# Altium schematic sheet Sheet1.SchDoc
size A1
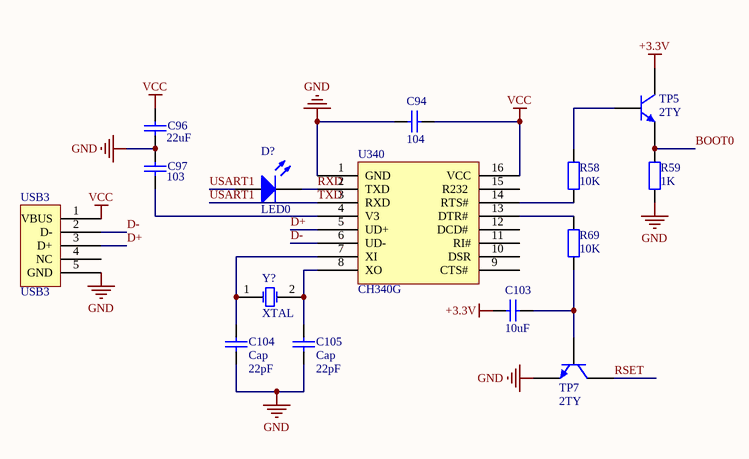
[diagram p0: Sheet1.SchDoc]

## Parts
C94  104  [RAD-0.3]
C96  value 22uF  [RAD-0.3]
C97  value 103  [RAD-0.3]
C103  10uF  [RAD-0.3]
C104  Cap  value 22pF  [RAD-0.3]
C105  Cap  value 22pF  [RAD-0.3]
D?  LED0  [LED-0]
R58  10K  [AXIAL-0.4]
R59  1K  [AXIAL-0.4]
R69  10K  [AXIAL-0.4]
TP5  2TY  [TO-92A]
TP7  2TY  [TO-92A]
U340  CH340G
USB3  USB3
Y?  XTAL  [R38]

## Nets
+3.3V: C103.2 TP5.3(C)
GND: C94.1 C96.1 C97.1 C104.1 C105.1 R59.1 TP7.1(E) U340.1(GND) USB3.5(GND)
VCC: C94.2 C96.2 U340.16(VCC) USB3.1(VBUS)
BOOT0: R59.2 TP5.1(E)
D+: U340.5(UD+) USB3.3(D+)
D-: U340.6(UD-) USB3.2(D-)
RSET: TP7.3(C)
RXD: D?.2(K) U340.2(TXD)
TXD: D?.1(A) U340.3(RXD)  [also labelled USART1]
NetC97_2: C97.2 U340.4(V3)
NetC103_1: C103.1 R69.1 TP7.2(B)
NetC104_2: C104.2 U340.7(XI) Y?.1(OSC1)
NetC105_2: C105.2 U340.8(XO) Y?.2(OSC2)
NetR58_1: R58.1 U340.14(RTS#)
NetR58_2: R58.2 TP5.2(B)
NetR69_2: R69.2 U340.13(DTR#)

Not connected (* = marked no-connect by the designer): U340 9(CTS#_) 10(DSR) 11(RI#) 12(DCD#_) 15(R232_); USB3 4(NC)

## Notes on the sheet
- Title
- Size:
- Date:
- File:
- A1
- Number:
- Time:
- Revision:
- Sheet
- of

## Library data of the parts
C94 = Cap: Capacitor; Value: 100pF; Published: 8-Jun-2000; LatestRevisionDate: 17-Jul-2002; LatestRevisionNote: Re-released for DXP Platform.; PackageReference: RAD-0.3; Publisher: Altium Limited; PackageDescription: Radial Cap, Thru-Hole; 2 Leads; 0.3 in Pin Spacing
C96 C97 C103-C105 = Cap: Capacitor; Published: 8-Jun-2000; LatestRevisionDate: 17-Jul-2002; LatestRevisionNote: Re-released for DXP Platform.; PackageReference: RAD-0.3; Publisher: Altium Limited; PackageDescription: Radial Cap, Thru-Hole; 2 Leads; 0.3 in Pin Spacing
  C103: Value: 10uF
D? = LED0: Typical INFRARED GaAs LED; Published: 8-Jun-2000; LatestRevisionDate: 08-Jul-2005; LatestRevisionNote: Mech Layer 1 removed.; PackageReference: LED-0; Publisher: Altium Limited; PackageDescription: LED; 2 Leads
R58 R69 = Res2: Resistor; Published: 8-Jun-2000; LatestRevisionDate: 17-Jul-2002; LatestRevisionNote: Re-released for DXP Platform.; PackageReference: AXIAL-0.4; Publisher: Altium Limited; PackageDescription: Axial Device, Thru-Hole; 2 Leads; 0.4 in Pin Spacing; Value: 10K
R59 = Res2: Resistor; Value: 10K; Published: 8-Jun-2000; LatestRevisionDate: 17-Jul-2002; LatestRevisionNote: Re-released for DXP Platform.; PackageReference: AXIAL-0.4; Publisher: Altium Limited; PackageDescription: Axial Device, Thru-Hole; 2 Leads; 0.4 in Pin Spacing
TP5 TP7 = 2N3904: NPN General Purpose Amplifier; Published: 8-Jun-2000; LatestRevisionDate: 15-Jan-2003; LatestRevisionNote: PCB Footprint 'BCY-W3/D4.7' replaced; DatasheetVersion: 1997; PackageVersion: Sep-1998; PackageReference: TO-92A; Publisher: Altium Limited; PackageDescription: TO, Flat Index; 3 In-Line, Axial Leads; Body Dia. 4.5mm; Leads 0.51 x 0.48 mm (max); ComponentLink1Description: Manufacturer Link; ComponentLink1URL: http://www.fairchildsemi.com/; ComponentLink2Description: Datasheet; ComponentLink2URL: http://www.fairchildsemi.com/ds/2N%2F2N3904.pdf
U340 = U340
Y? = XTAL: Crystal Oscillator; Published: 8-Jun-2000; LatestRevisionDate: 17-Jul-2002; LatestRevisionNote: Re-released for DXP Platform.; PackageReference: R38; Publisher: Altium Limited; PackageDescription: Crystal, Thru-Hole; 2 Leads; Body 3.1 x 8.2 mm (Dia.xH)